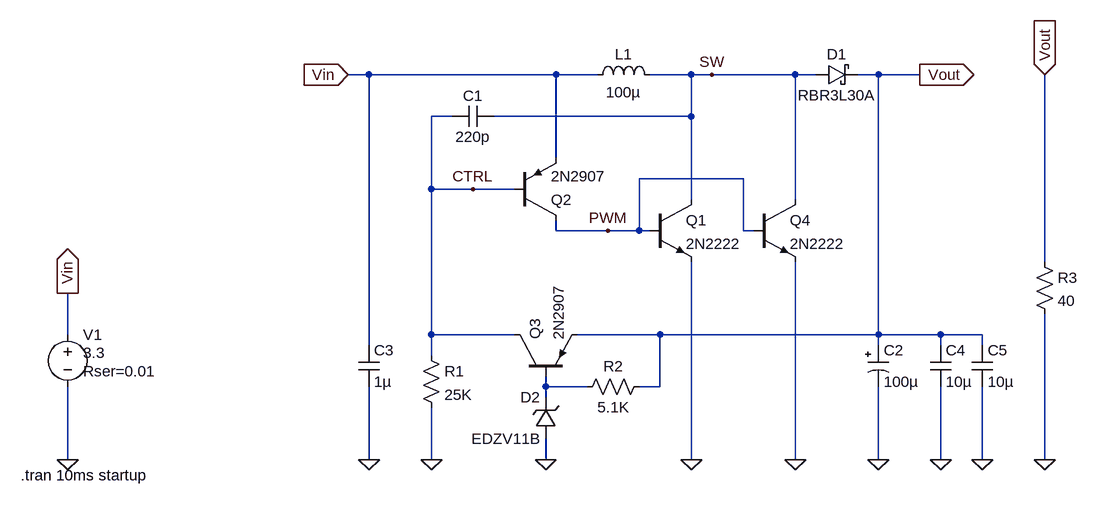
[diagram p0: schematic Boost_SMPL.asc]
Boost_SMPL.asc, the LTspice schematic file:
Version 4
SHEET 1 904 760
WIRE -208 128 -240 128
WIRE 80 128 -208 128
WIRE 144 128 80 128
WIRE 288 128 224 128
WIRE 320 128 288 128
WIRE 448 128 320 128
WIRE 480 128 448 128
WIRE 576 128 544 128
WIRE 640 128 576 128
WIRE -80 192 -112 192
WIRE 288 192 288 128
WIRE 288 192 -16 192
WIRE 80 256 80 128
WIRE 368 288 208 288
WIRE -112 304 -112 192
WIRE -48 304 -112 304
WIRE 16 304 -48 304
WIRE 288 320 288 192
WIRE 448 320 448 128
WIRE 80 368 80 352
WIRE 160 368 80 368
WIRE 208 368 208 288
WIRE 208 368 160 368
WIRE 224 368 208 368
WIRE 368 368 368 288
WIRE 384 368 368 368
WIRE 832 416 832 128
WIRE -672 528 -672 464
WIRE -112 528 -112 304
WIRE 16 528 -112 528
WIRE 240 528 112 528
WIRE 576 528 576 128
WIRE 576 528 240 528
WIRE 672 528 576 528
WIRE 736 528 672 528
WIRE -208 544 -208 128
WIRE 576 544 576 528
WIRE 672 544 672 528
WIRE 736 544 736 528
WIRE -112 560 -112 528
WIRE 64 608 64 592
WIRE 128 608 64 608
WIRE 240 608 240 528
WIRE 240 608 208 608
WIRE 64 624 64 608
WIRE -672 720 -672 608
WIRE -208 720 -208 608
WIRE -112 720 -112 640
WIRE 64 720 64 688
WIRE 288 720 288 416
WIRE 448 720 448 416
WIRE 576 720 576 608
WIRE 672 720 672 608
WIRE 736 720 736 608
WIRE 832 720 832 496
FLAG 288 720 0
FLAG 576 720 0
FLAG 64 720 0
FLAG -112 720 0
FLAG -208 720 0
FLAG -240 128 Vin
IOPIN -240 128 In
FLAG 640 128 Vout
IOPIN 640 128 Out
FLAG -672 720 0
FLAG -672 464 Vin
IOPIN -672 464 Out
FLAG 320 128 SW
FLAG 160 368 PWM
FLAG -48 304 CTRL
FLAG 832 720 0
FLAG 832 128 Vout
IOPIN 832 128 In
FLAG 448 720 0
FLAG 672 720 0
FLAG 736 720 0
SYMBOL ind 128 144 R270
WINDOW 0 32 56 VTop 2
WINDOW 3 5 56 VBottom 2
SYMATTR InstName L1
SYMATTR Value 100µ
SYMATTR SpiceLine Ipk=2.2 Rser=0.184 Rpar=9420 Cpar=0 mfg="Coilcraft" pn="RFS1113-104"
SYMBOL npn2 224 320 R0
SYMATTR InstName Q1
SYMATTR Value 2N2222
SYMBOL schottky 480 144 R270
WINDOW 0 32 32 VTop 2
WINDOW 3 0 32 VBottom 2
SYMATTR InstName D1
SYMATTR Value RBR3L30A
SYMATTR Description Diode
SYMATTR Type diode
SYMBOL pnp 16 352 M180
SYMATTR InstName Q2
SYMATTR Value 2N2907
SYMBOL cap -16 176 R90
WINDOW 0 0 32 VBottom 2
WINDOW 3 32 32 VTop 2
SYMATTR InstName C1
SYMATTR Value 220p
SYMATTR SpiceLine V=50 Irms=23.8m Rser=13.9748 Lser=0
SYMBOL res -128 544 R0
SYMATTR InstName R1
SYMATTR Value 25K
SYMATTR SpiceLine tol=1 pwr=0.1
SYMBOL pnp 16 592 R270
SYMATTR InstName Q3
SYMATTR Value 2N2907
SYMBOL zener 80 688 R180
WINDOW 0 24 64 Left 2
WINDOW 3 24 0 Left 2
SYMATTR InstName D2
SYMATTR Value EDZV11B
SYMATTR Description Diode
SYMATTR Type diode
SYMBOL res 112 624 R270
WINDOW 0 32 56 VTop 2
WINDOW 3 0 56 VBottom 2
SYMATTR InstName R2
SYMATTR Value 5.1K
SYMATTR SpiceLine tol=1 pwr=0.1
SYMBOL polcap 560 544 R0
WINDOW 3 24 56 Left 2
SYMATTR Value 100µ
SYMATTR InstName C2
SYMATTR SpiceLine V=35 Irms=190m Rser=0.5 Lser=0 mfg="Nichicon" pn="UPR1V101MPH" type="Al electrolytic"
SYMATTR Description Capacitor
SYMATTR Type cap
SYMBOL cap -224 544 R0
SYMATTR InstName C3
SYMATTR Value 1µ
SYMATTR SpiceLine V=16 Irms=2.59 Rser=0.0171188 Lser=0 mfg="KEMET" pn="C0603C105K4RAC" type="X7R"
SYMBOL voltage -672 512 R0
WINDOW 3 24 44 Left 2
WINDOW 123 0 0 Left 0
WINDOW 39 24 72 Left 2
SYMATTR Value 3.3
SYMATTR SpiceLine Rser=0.01
SYMATTR InstName V1
SYMBOL res 816 400 R0
SYMATTR InstName R3
SYMATTR Value 40
SYMATTR SpiceLine tol=1 pwr=10
SYMBOL npn2 384 320 R0
SYMATTR InstName Q4
SYMATTR Value 2N2222
SYMBOL cap 656 544 R0
SYMATTR InstName C4
SYMATTR Value 10µ
SYMATTR SpiceLine V=35 Irms=8.06 Rser=0.00577565 Lser=0 mfg="KEMET" pn="C1210C106K6PAC" type="X5R"
SYMBOL cap 720 544 R0
SYMATTR InstName C5
SYMATTR Value 10µ
SYMATTR SpiceLine V=35 Irms=8.06 Rser=0.00577565 Lser=0 mfg="KEMET" pn="C1210C106K6PAC" type="X5R"
TEXT -744 744 Left 2 !.tran 10ms startup

The netlist it stands for:
* Boost_SMPL.asc
L1 Vin SW 100µ Ipk=2.2 Rser=0.184 Rpar=9420 Cpar=0 mfg="Coilcraft" pn="RFS1113-104"
Q1 SW PWM 0 0 2N2222
D1 SW Vout RBR3L30A
Q2 PWM CTRL Vin 0 2N2907
C1 SW CTRL 220p V=50 Irms=23.8m Rser=13.9748 Lser=0
R1 CTRL 0 25K tol=1 pwr=0.1
Q3 CTRL N001 Vout 0 2N2907
D2 0 N001 EDZV11B
R2 N001 Vout 5.1K tol=1 pwr=0.1
C2 Vout 0 100µ V=35 Irms=190m Rser=0.5 Lser=0 mfg="Nichicon" pn="UPR1V101MPH" type="Al electrolytic"
C3 Vin 0 1µ V=16 Irms=2.59 Rser=0.0171188 Lser=0 mfg="KEMET" pn="C0603C105K4RAC" type="X7R"
V1 Vin 0 3.3 Rser=0.01
R3 Vout 0 40 tol=1 pwr=10
Q4 SW PWM 0 0 2N2222
C4 Vout 0 10µ V=35 Irms=8.06 Rser=0.00577565 Lser=0 mfg="KEMET" pn="C1210C106K6PAC" type="X5R"
C5 Vout 0 10µ V=35 Irms=8.06 Rser=0.00577565 Lser=0 mfg="KEMET" pn="C1210C106K6PAC" type="X5R"
.model D D
.lib standard.dio
.model NPN NPN
.model PNP PNP
.lib standard.bjt
.tran 10ms startup
.backanno
.end